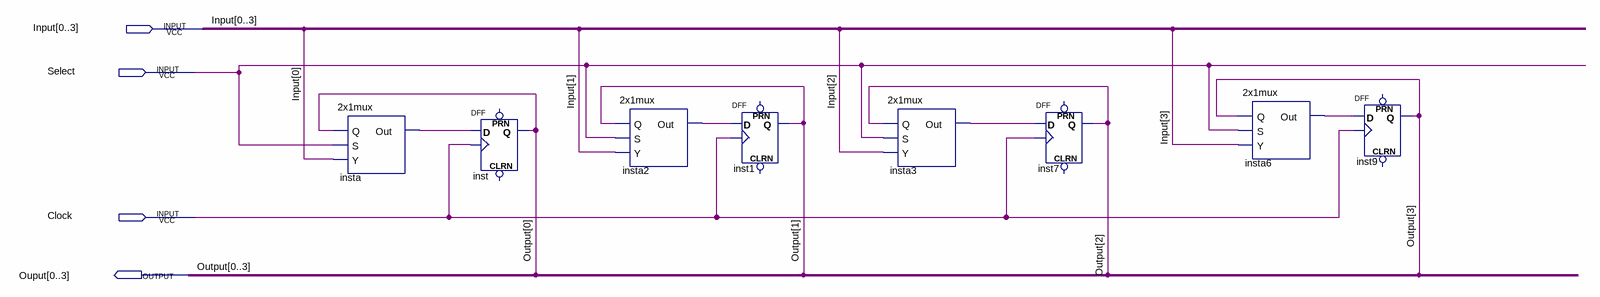
[diagram p0: schematic sheet]
// Quartus schematic 4BitReg.bdf as structural Verilog: 8 symbols, 4 pins
module \4BitReg  (
  input  [0:3] Input,
  input  Select,
  input  Clock,
  output [0:3] Ouput
);

  wire insta2_out, insta3_out, insta6_out, insta_out;

  \2x1mux  insta (.Q(Ouput[0]), .S(Select), .Y(Input[0]), .Out(insta_out));
  DFF inst (.CLK(Clock), .D(insta_out), .Q(Ouput[0]));  // open: CLRN, PRN
  \2x1mux  insta2 (.Q(Ouput[1]), .S(Select), .Y(Input[1]), .Out(insta2_out));
  DFF inst1 (.CLK(Clock), .D(insta2_out), .Q(Ouput[1]));  // open: CLRN, PRN
  \2x1mux  insta3 (.Q(Ouput[2]), .S(Select), .Y(Input[2]), .Out(insta3_out));
  DFF inst7 (.CLK(Clock), .D(insta3_out), .Q(Ouput[2]));  // open: CLRN, PRN
  \2x1mux  insta6 (.Q(Ouput[3]), .S(Select), .Y(Input[3]), .Out(insta6_out));
  DFF inst9 (.CLK(Clock), .D(insta6_out), .Q(Ouput[3]));  // open: CLRN, PRN

  // Other names for the same wires on the sheet: Output[3:0] = {Ouput[3], Ouput[2], Ouput[1], Ouput[0]}
endmodule
